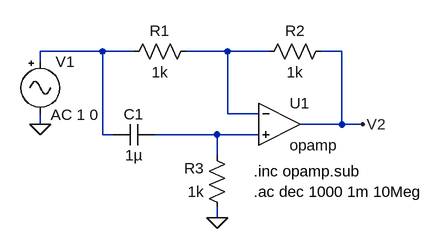
[diagram p0: schematic TS1_LTSpiceCircuitoPunto5_Albanesi.asc]
TS1_LTSpiceCircuitoPunto5_Albanesi.asc, the LTspice schematic file:
Version 4
SHEET 1 880 680
WIRE 32 96 -64 96
WIRE 80 96 32 96
WIRE 224 96 160 96
WIRE 288 96 224 96
WIRE 400 96 368 96
WIRE -64 112 -64 96
WIRE 224 192 224 96
WIRE 272 192 224 192
WIRE -64 208 -64 192
WIRE 400 208 400 96
WIRE 400 208 336 208
WIRE 432 208 400 208
WIRE 32 224 32 96
WIRE 48 224 32 224
WIRE 208 224 112 224
WIRE 272 224 208 224
WIRE 208 256 208 224
WIRE 208 352 208 336
FLAG 208 352 0
FLAG -64 208 0
FLAG 432 208 V2
SYMBOL res 176 80 R90
WINDOW 0 0 56 VBottom 2
WINDOW 3 32 56 VTop 2
SYMATTR InstName R1
SYMATTR Value 1k
SYMBOL res 384 80 R90
WINDOW 0 0 56 VBottom 2
WINDOW 3 32 56 VTop 2
SYMATTR InstName R2
SYMATTR Value 1k
SYMBOL res 224 352 R180
WINDOW 0 36 76 Left 2
WINDOW 3 36 40 Left 2
SYMATTR InstName R3
SYMATTR Value 1k
SYMBOL cap 112 208 R90
WINDOW 0 0 32 VBottom 2
WINDOW 3 32 32 VTop 2
SYMATTR InstName C1
SYMATTR Value 1µ
SYMBOL OpAmps\\opamp 304 144 R0
SYMATTR InstName U1
SYMBOL Misc\\signal -64 96 R0
WINDOW 3 -99 193 Left 2
WINDOW 123 16 97 Left 2
WINDOW 39 0 0 Left 0
SYMATTR InstName V1
SYMATTR Value ""
SYMATTR Value2 AC 1 0
TEXT 264 280 Left 2 !.inc opamp.sub
TEXT 264 312 Left 2 !.ac dec 1000 1m 10Meg

The netlist it stands for:
* TS1_LTSpiceCircuitoPunto5_Albanesi.asc
R1 N002 N001 1k
R2 V2 N002 1k
R3 0 N003 1k
C1 N003 N001 1µ
XU1 N002 N003 V2 opamp Aol=100K GBW=10Meg  ; pins invin noninvin out
V1 N001 0 AC 1 0
.inc opamp.sub
.ac dec 1000 1m 10Meg
.backanno
.end